# Altium schematic sheet LJU_SNAP.SchDoc
size A3; SheetNumber: 1; SheetTotal: 1
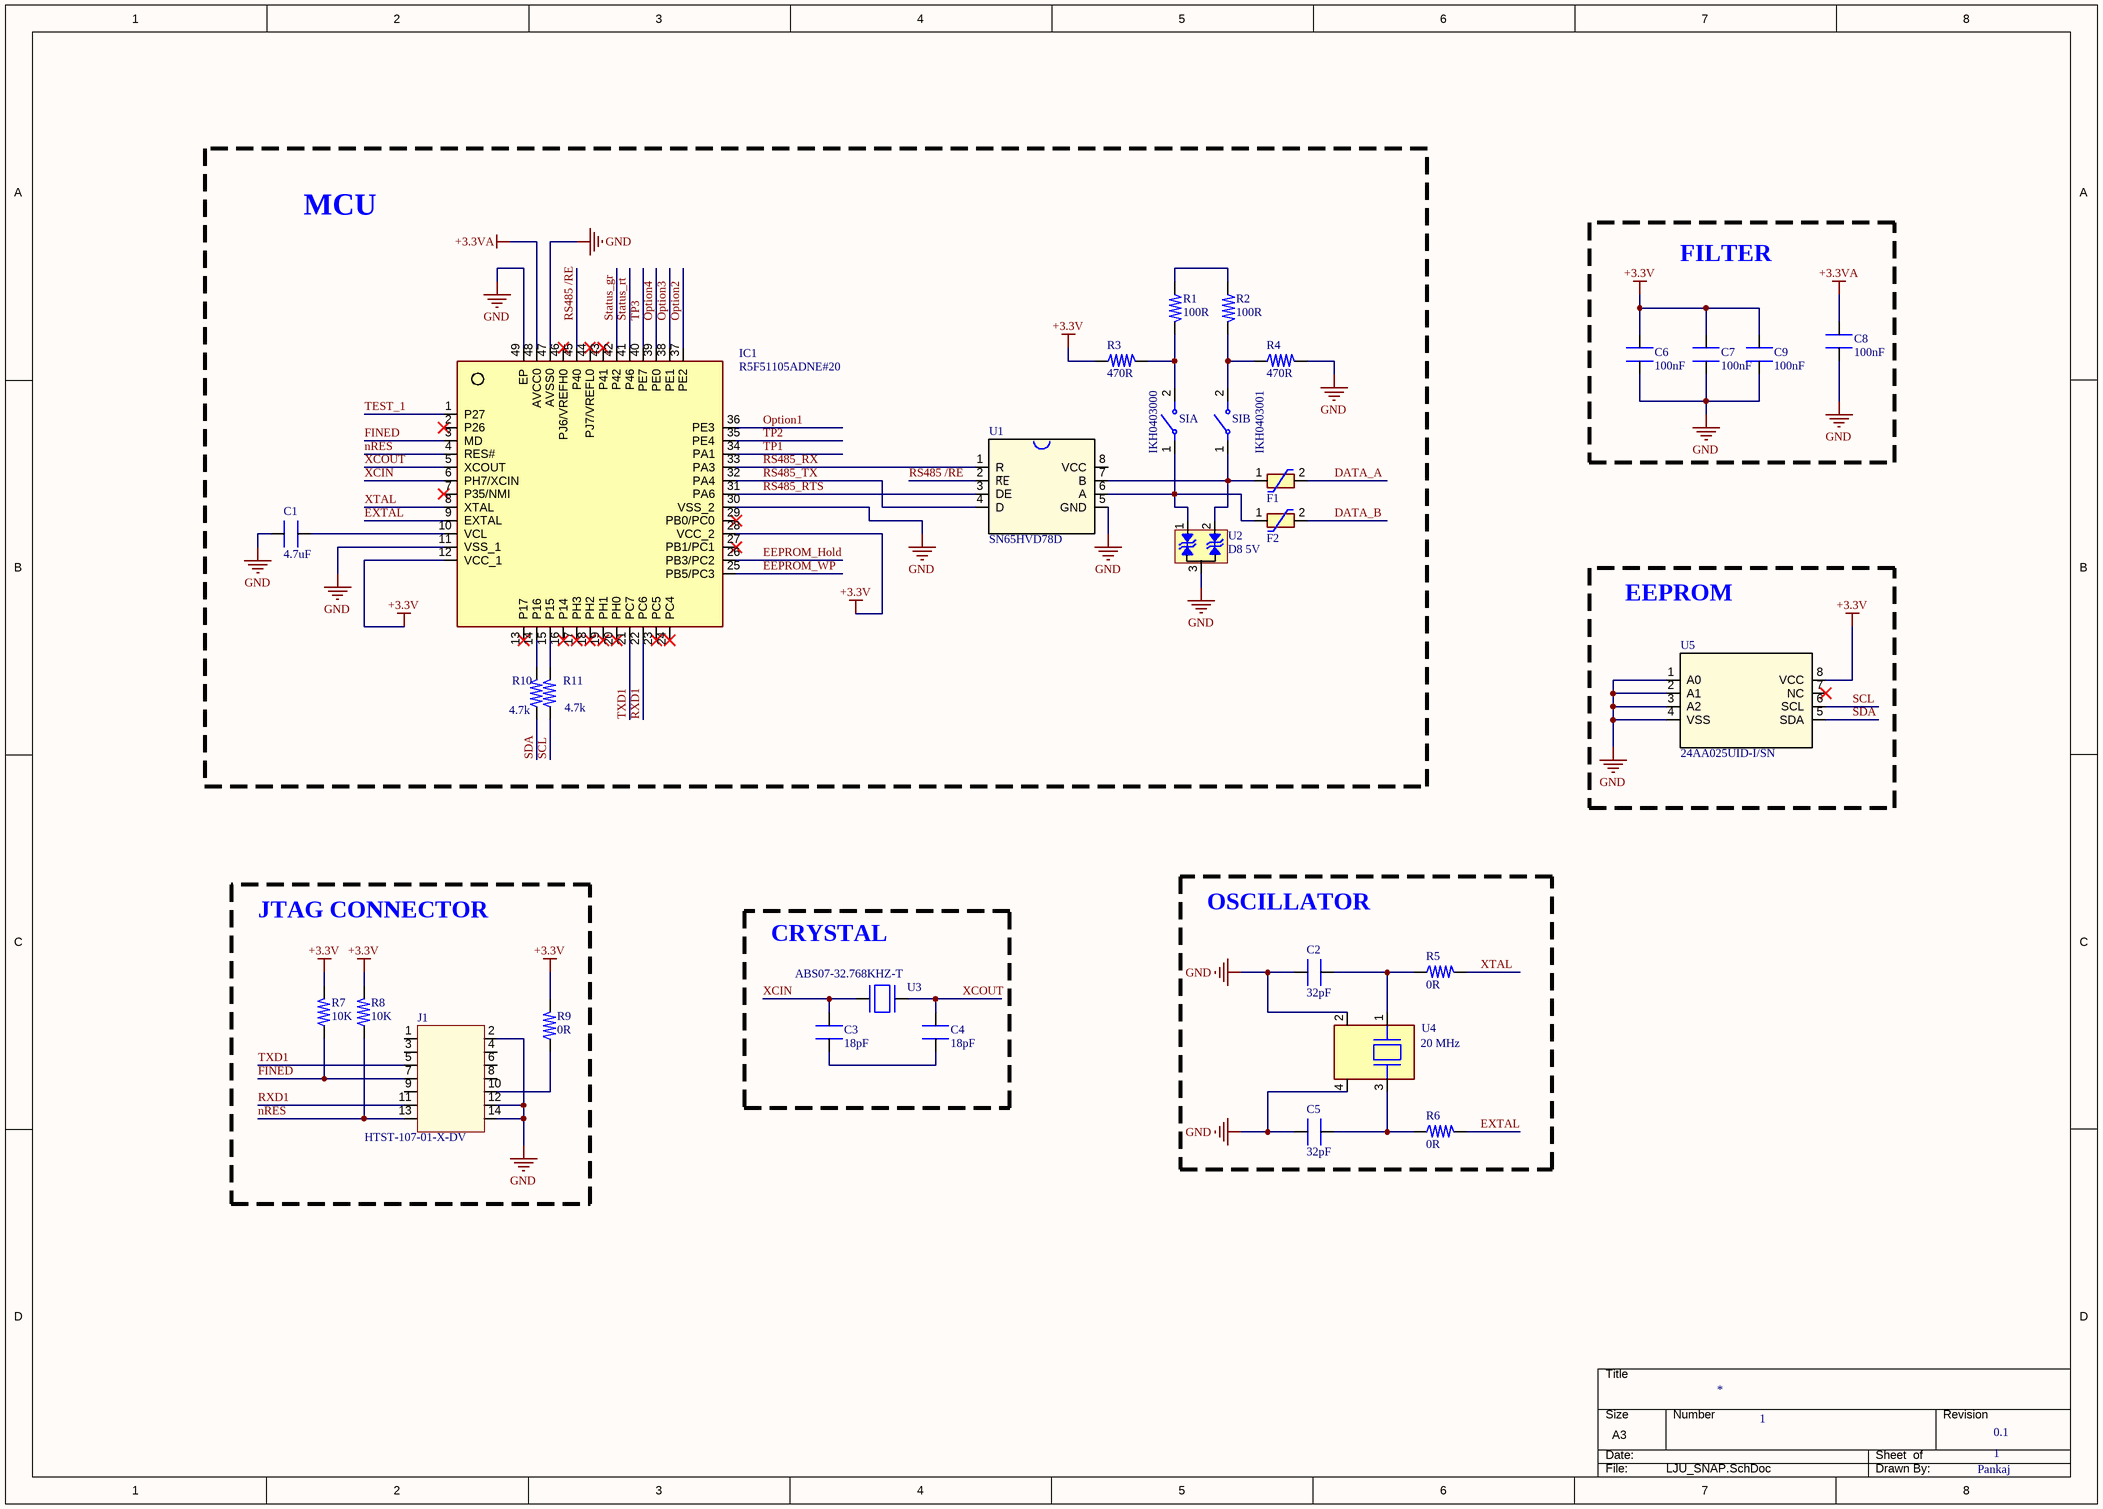
[diagram p0: LJU_SNAP.SchDoc]

## Parts
C1  4.7uF  [CAP]
C2  32pF  [CAP]
C3  18pF  [CAP]
C4  18pF  [CAP]
C5  32pF  [CAP]
C6  100nF  [CAP]
C7  100nF  [CAP]
C8  100nF  [CAP]
C9  100nF  [CAP]
F1  FUSE  [RESC3216X125N]  (value not drawn)
F2  FUSE  [RESC3216X125N]  (value not drawn)
IC1  R5F51105ADNE#20  [QFN50P700X700X80-49N-D]
IKH1  SIA  [SW_DS01-254-L-01BE]
IKH2  SIB  [SW_DS01-254-L-01BE]
J1  HTST-107-01-X-DV  [SAMTEC-HTST-107-01-X-DV]
R1  100R  [RES]
R2  100R  [RES]
R3  470R  [RES]
R4  470R  [RES]
R5  0R  [RES]
R6  0R  [RES]
R7  10K  [RES]
R8  10K  [RES]
R9  0R  [RES]
R10  4.7k  [RES]
R11  4.7k  [RES]
U1  SN65HVD78D  [D8_TEX]
U2  D8 5V  [SOT-23-3_DBZ_TEX]
U3  ABS07-32.768KHZ-T  [XTAL_ABS07-32.768KHZ-T]
U4  20 MHz  [XTAL_ABM8AIG-20.000MHZ-12-2Z-T3]
U5  24AA025UID-I/SN  [SOIC8-N_MC_MCH]

## Blocks framed on the sheet
MCU: C1 F1 F2 IC1 IKH1 IKH2 R1-R4 R10 R11 U1 U2
FILTER: C6-C9
EEPROM: U5
OSCILLATOR: C2 C5 R5 R6 U4
JTAG CONNECTOR: J1 R7-R9
CRYSTAL: C3 C4 U3

## Nets
+3.3V: C6.2 C7.2 C9.2 IC1.12(VCC_1) IC1.28(VCC_2) R3.1 R7.2 R8.2 R9.2 U5.8(VCC)
+3.3VA: C8.2 IC1.48(AVCC0)
GND: C1.1 C2.1 C5.1 C6.1 C7.1 C8.1 C9.1 IC1.11(VSS_1) IC1.30(VSS_2) IC1.47(AVSS0) IC1.49(EP) J1.2 J1.12 J1.14 R4.2 U1.5(GND) U2.3 U4.2(GND) U4.4(GND) U5.1(A0) U5.2(A1) U5.3(A2) U5.4(VSS)
DATA_A: F1.2
DATA_B: F2.2
EEPROM_Hold: IC1.26(PB3/PC2)
EEPROM_WP: IC1.25(PB5/PC3)
EXTAL: IC1.9(EXTAL) R6.2
FINED: IC1.3(MD) J1.7 R7.1
nRES: IC1.4(RES#) J1.13 R8.1
Option1: IC1.36(PE3)
Option2: IC1.37(PE2)
Option3: IC1.38(PE1)
Option4: IC1.39(PE0)
RS485 /RE: IC1.45(P40) U1.2(R̅E̅)
RS485_RTS: IC1.31(PA6) U1.3(DE)
RS485_RX: IC1.33(PA3) U1.1(R)
RS485_TX: IC1.32(PA4) U1.4(D)
RXD1: IC1.22(PC6) J1.11
SCL: R11.1 U5.6(SCL)
SDA: R10.1 U5.5(SDA)
Status_gr: IC1.42(P42)
Status_rt: IC1.41(P46)
TEST_1: IC1.1(P27)
TP1: IC1.34(PA1)
TP2: IC1.35(PE4)
TP3: IC1.40(PE7)
TXD1: IC1.21(PC7) J1.5
XCIN: C3.2 IC1.6(PH7/XCIN) U3.1
XCOUT: C4.2 IC1.5(XCOUT) U3.2
XTAL: IC1.8(XTAL) R5.2
NetC1_2: C1.2 IC1.10(VCL)
NetC2_2: C2.2 R5.1 U4.1
NetC3_1: C3.1 C4.1
NetC5_2: C5.2 R6.1 U4.3
NetF1_1: F1.1 IKH2.1 U1.7(B) U2.2
NetF2_1: F2.1 IKH1.1 U1.6(A) U2.1
NetIC1_14: IC1.14(P16) R10.2
NetIC1_15: IC1.15(P15) R11.2
NetIKH1_2: IKH1.2 R1.2 R3.2
NetIKH2_2: IKH2.2 R2.2 R4.1
NetJ1_10: J1.10 R9.1
NetR1_1: R1.1 R2.1

Not connected (* = marked no-connect by the designer): IC1 2(P26)* 7(P35/NMI)* 13(P17)* 16(P14)* 17(PH3)* 18(PH2)* 19(PH1)* 20(PH0)* 23(PC5)* 24(PC4)* 27(PB1/PC1)* 29(PB0/PC0)* 43(P41)* 44(PJ7/VREFL0)* 46(PJ6/VREFH0)*; J1 1 3 4 6 8 9; U1 8(VCC); U5 7(NC)*

## Notes on the sheet
- (near IKH1) IKH0403000
- IKH0403001
- 0.1
- Pankaj
- THIS DOCUMENT AND THE DATA DISCLOSED HEREIN OR
- HEREWITH IS THE PROPERTY OF ALTIUM LIMITED AND MAY
- DWG NO:
- REVISION
- REV:
- DESCRIPTION
- DATE
- APPROVED
- BE FREELY DISTRIBUTED IN WHOLE. NO RIGHTS ARE
- RESERVED OR EXPRESS OR IMPLIED WARANTEE GIVEN.
- ENG:
- APPROVALS
- PROJECT
- DSN:
- CHK:
- REFERENCE DOCUMENTS
- PROJECT REVISION:
- TITLE
- DOCUMENT REVISION:
- DESIGN ITEM:
- BOM:
- FAB DWG:
- PCB DWG:
- ASSY DWG:
- SCALE:
- A3
- SIZE
- CAGE CODE
- FILE NAME
- DWG NO.
- SHEET
- OF
- REV

## Library data of the parts
C1 = GRM188R61E475KE11D: 4.7 µF ±10% 25V Ceramic Capacitor X5R 0603 (1608 Metric); Manufacturer: KEMET; Manufacturing Part Number: C0603C104K5RACTU; Case/Package: 0603
C2 C5 = 06035A320FAT4A: 32 pF ±1% 50V Ceramic Capacitor C0G, NP0 0603 (1608 Metric); Manufacturer: KEMET; Manufacturing Part Number: C0603C104K5RACTU; Case/Package: 0603
C3 C4 = 04023K210FBWTR\500: CAP THIN FILM 21PF 25V 0402; Manufacturer: KEMET; Manufacturing Part Number: C0603C104K5RACTU; Case/Package: 0603
C6-C9 = CL10E104KC8VPNC: 100 nF ±10% 100V Ceramic Capacitor X8L 0603 (1608 Metric); Manufacturer: KEMET; Manufacturing Part Number: C0603C104K5RACTU; Case/Package: 0603
F1 F2 = PTS120624V020: Polymeric PTC Resettable Fuse 24V 200 mA Ih Surface Mount 1206 (3216 Metric), Concave; Manufacture NO.: 0679L3000-01; MF: Panasonic; MP: ERB-RE5R00V; SnapEDA_Link: https://www.snapeda.com/parts/ERB-RE5R00V/Panasonic/view-part/?ref=snap; Package: 0603 Panasonic Electronic Components; Check_prices: https://www.snapeda.com/parts/ERB-RE5R00V/Panasonic/view-part/?ref=eda
IC1 = R5F51105ADNE#20: Integrated Circuit; Manufacturer_Name: Renesas Electronics; Datasheet Link: https://www.renesas.com/us/en/products/microcontrollers-microprocessors/rx-32-bit-performance-efficiency-mcus/rx110-32-bit-microcontrollers-featuring-ultra-low-power-consumption; Height: 0.8mm; Manufacturer_Part_Number: R5F51105ADNE#20
IKH1 IKH2 = IKH0403000
J1 = SAMTEC-HTST-107-01-X-DV: Price: None; Availability: Unavailable; Package: None; MP: SAMTEC-HTST-107-01-X-DV; Value: *
R1 R2 = RC0603FR-07100RL: 100 Ohms ±1% 0.1W, 1/10W Chip Resistor 0603 (1608 Metric) Moisture Resistant Thick Film; Manufacturer: Vishay Dale; Manufacturer Part Number: CRCW0603590KFKEA; Case/Package: 0603
R3 R4 = RC0603JR-07470RL: 470 Ohms ±5% 0.1W, 1/10W Chip Resistor 0603 (1608 Metric) Moisture Resistant Thick Film; Manufacturer: Vishay Dale; Manufacturer Part Number: CRCW0603590KFKEA; Case/Package: 0603
R5 R6 R9 = CR0603PB0RS001: 0 Ohms Jumper 0.1W, 1/10W Chip Resistor 0603 (1608 Metric) Thick Film; Manufacturer: YAGEO; Manufacturer Part Number: RC0603FR-0710KL; Case/Package: 0603
R7 R8 = RC0603FR-0710KL: 10 kOhms ±1% 0.1W, 1/10W Chip Resistor 0603 (1608 Metric) Moisture Resistant Thick Film; Manufacturer: YAGEO; Manufacturer Part Number: RC0603FR-0710KL; Case/Package: 0603
R10 R11 = RC0603FR-074K7L: 4.7 kOhms ±1% 0.1W, 1/10W Chip Resistor 0603 (1608 Metric) Moisture Resistant Thick Film; Manufacturer: YAGEO; Manufacturer Part Number: RC0603FR-0710KL; Case/Package: 0603
U1 = SN65HVD78D: 3.3 V Half-Duplex RS-485, with IEC ESD, 50 Mbps 8-SOIC -40 to 125; Manufacturer_Name: Texas Instruments; Copyright: Copyright (C) 2025 Ultra Librarian. All rights reserved.; Manufacturer_Part_Number: SN65HVD78D; RefDes: RefDes; Type: Type
U2 = ESD562DBZR: Two-channel bidirectional 12V ESD protection diode 3-SOT-23 -40 to 125
U3 = ABS07-32.768KHZ-T: 32.768 kHz Â±20ppm Crystal 12.5pF 70 kOhms 2-SMD, No Lead; MF: Abracon; Availability: In Stock; SnapEDA_Link: https://www.snapeda.com/parts/ABS07-32.768KHZ-T/Abracon+LLC/view-part/?ref=snap; MP: ABS07-32.768KHZ-T; Price: None; Value: *; Check_prices: https://www.snapeda.com/parts/ABS07-32.768KHZ-T/Abracon+LLC/view-part/?ref=eda; Purchase-URL: https://pricing.snapeda.com/search/part/ABS07-32.768KHZ-T/?ref=eda; Package: SMD-2 Abracon LLC
U4 = ABM8AIG-20.000MHZ-12-2Z-T3: 20 MHz Â±20ppm Crystal 12pF 50 Ohms 4-SMD, No Lead; MF: Abracon; Check_prices: https://www.snapeda.com/parts/ABM8AIG-20.000MHZ-12-2Z-T3/Abracon/view-part/?ref=eda; Availability: In Stock; Package: NON STANDARD Abracon; MP: ABM8AIG-20.000MHZ-12-2Z-T3; Value: *; Purchase-URL: https://pricing.snapeda.com/search/part/ABM8AIG-20.000MHZ-12-2Z-T3/?ref=eda; SnapEDA_Link: https://www.snapeda.com/parts/ABM8AIG-20.000MHZ-12-2Z-T3/Abracon/view-part/?ref=snap; Price: None
U5 = 24AA025UID-ISN: EEPROM Memory IC 2Kbit I2C 400 kHz 900 ns 8-SOIC; Manufacturer_Name: Microchip; Copyright: Copyright (C) 2025 Ultra Librarian. All rights reserved.; Manufacturer_Part_Number: 24AA025UID-I/SN; RefDes: RefDes; Type: Type